# EAGLE design 02A-001 (EAGLE 9.6.2)
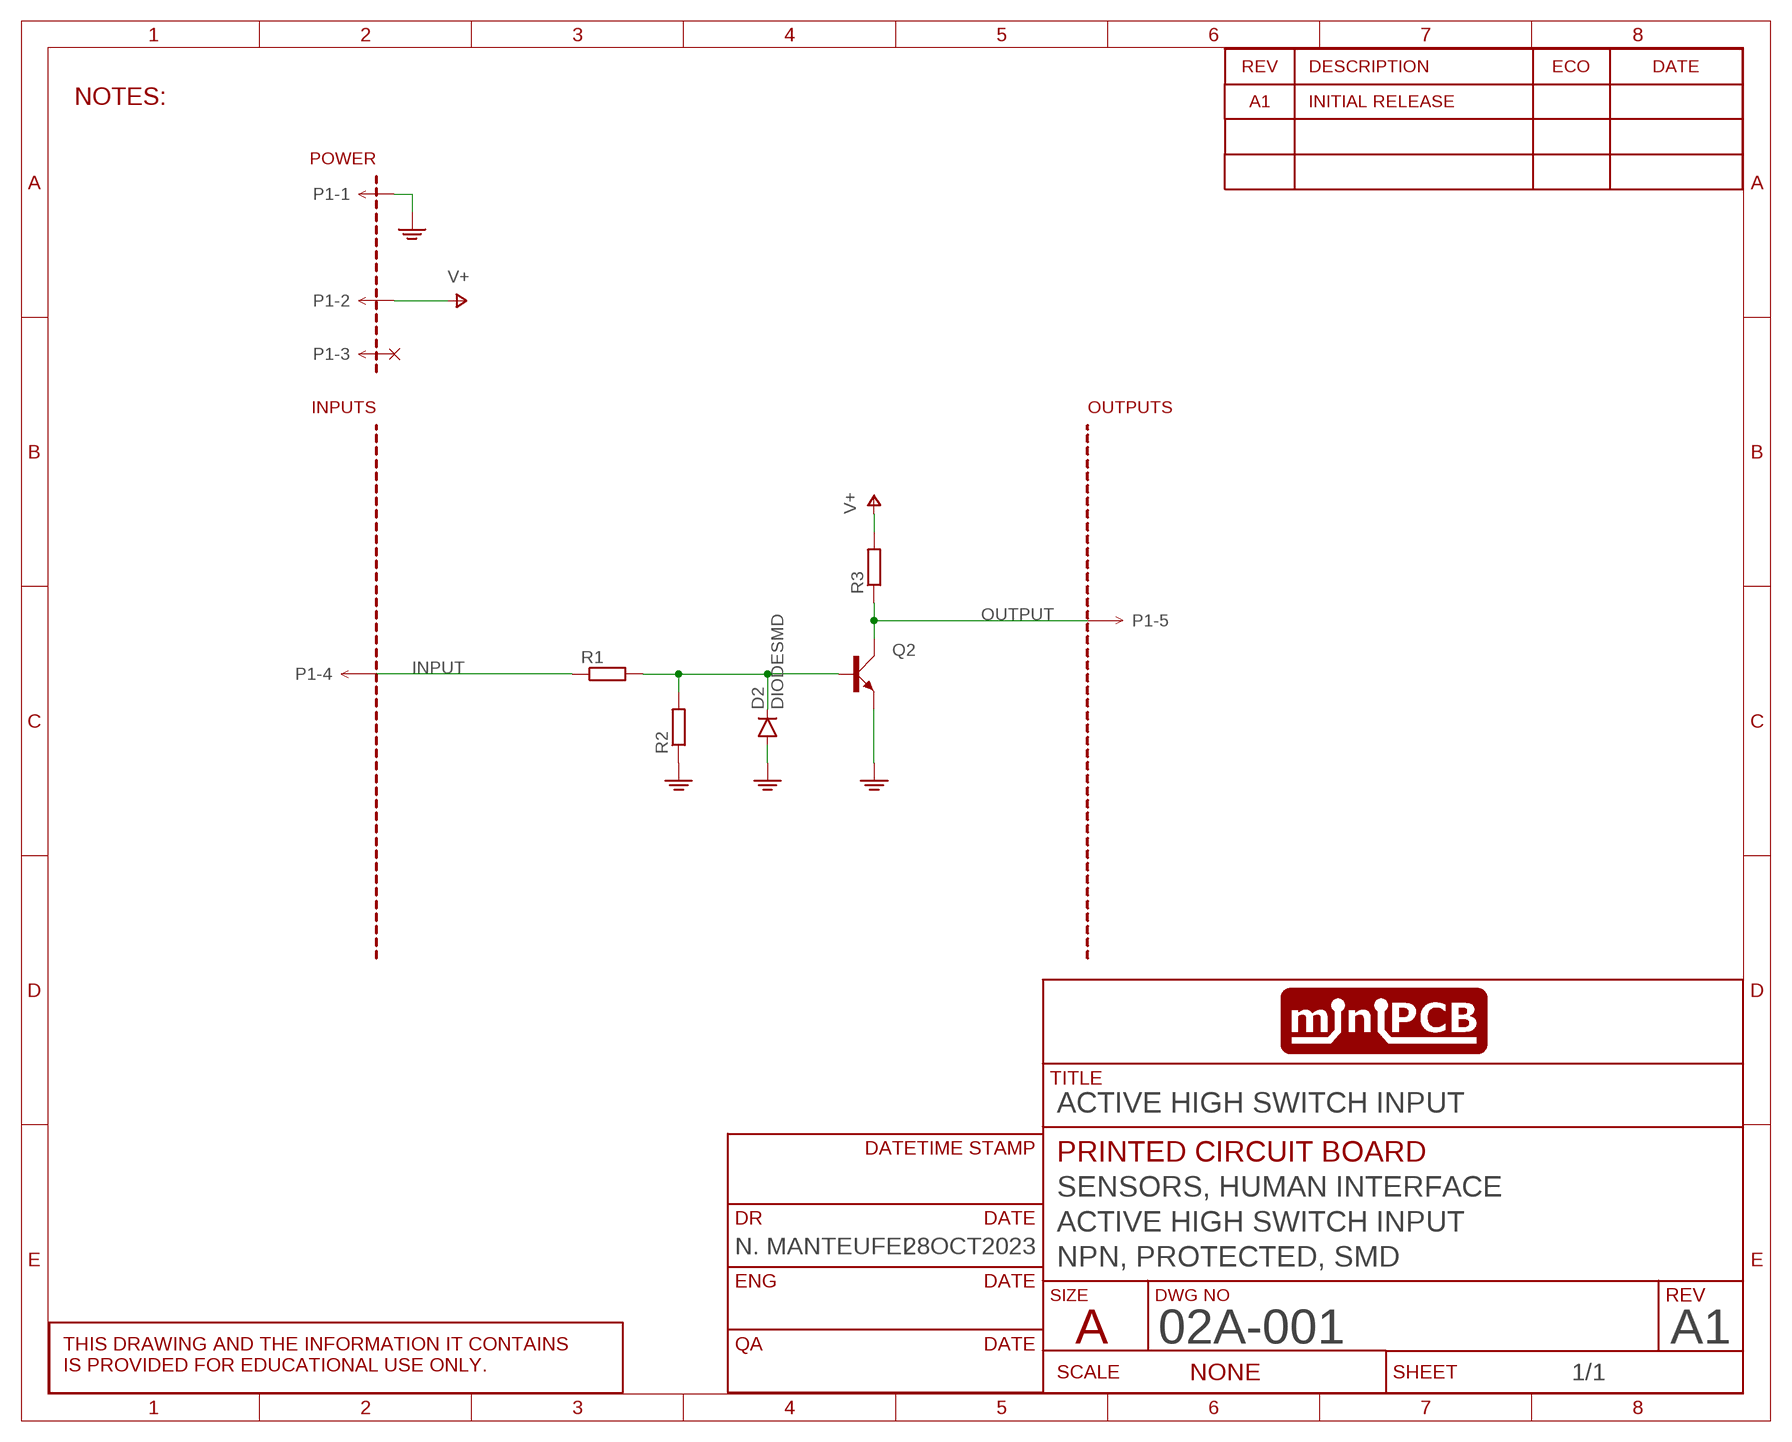
[diagram p0: schematic, sheet 1]
SHEET1 (SCHEMATIC): CIRCUIT_CATEGORY: SENSORS, HUMAN INTERFACE; CIRCUIT_NAME: ACTIVE HIGH SWITCH INPUT; CIRCUIT_VARIANT: NPN, PROTECTED, SMD; DR: N. MANTEUFEL; DR_DATE: 28OCT2023; PCB_PCBA: PRINTED CIRCUIT BOARD; REVA: A1; REVISION: A1; TITLE: ACTIVE HIGH SWITCH INPUT

## Parts
D2  DIODESMD  [DO214AC]
P1  MINIPCB_5P5P  [PINS_1X5]
PCB1  MINIPCB_0P00A-20X25  [MINIPCB_00A_20X25]
Q2  BJT_NPNBEC  [SOT23]
R1  RESISTORSMD  [R0805]
R2  RESISTORSMD  [R0805]
R3  RESISTORSMD  [R0805]

## Nets
GND: D2.A P1.1 Q2.2(E) R2.1
INPUT: P1.4 R1.1
OUTPUT: P1.5 Q2.3(C) R3.1
PROTECTED_INPUT: D2.C Q2.1(B) R1.2 R2.2
V+: P1.2 R3.2
Unconnected: P1.3

## Notes on the sheet
- NOTES:

## Library data of the parts
D2 = minipcb:DIODE
P1 = minipcb:MINIPCB_5P
PCB1 = minipcb:MINIPCB_0P; CIRCUIT_CATEGORY: CIRCUIT CATEGORY; PART_NUMBER: 02A-001; REVISION: A1-01; TITLE: TITLE
Q2 = minipcb:BJT_NPN: TRANSISTOR
R1-R3 = minipcb:RESISTOR

## Board
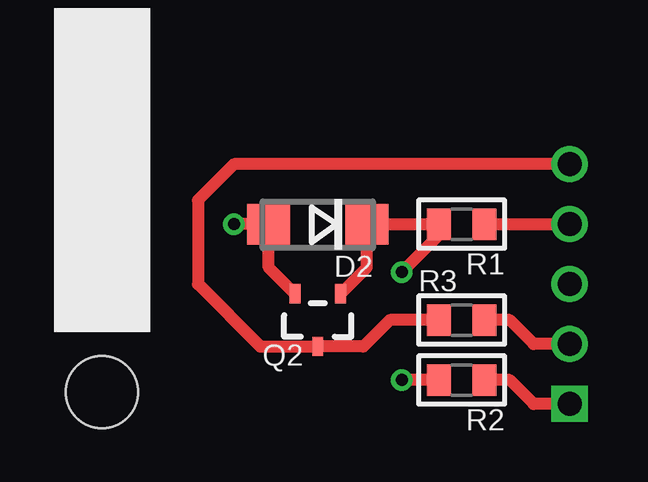
[diagram p1: board, top side]
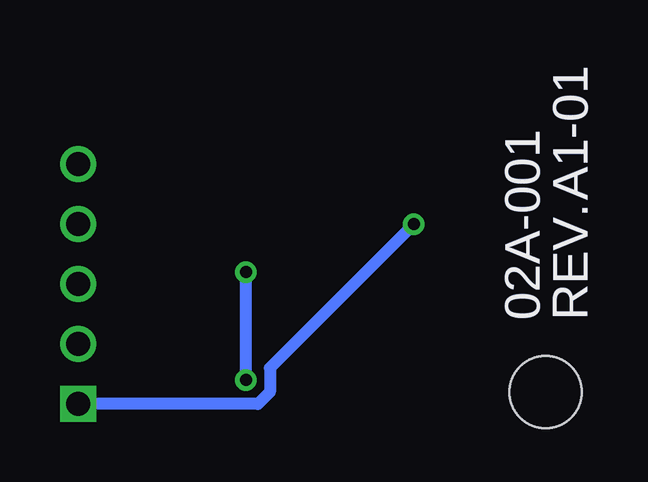
[diagram p2: board, bottom side, seen from below]

No outline drawn. Coordinates in mm, seen from the top.
Copper layers (1*16): Top 0.035mm / dielectric 1.5mm / Bottom 0.035mm
Design rules "default": minimum track width 6mil, minimum drill 0.35mm, track to track 6mil, track to pad 6mil, pad to pad 6mil, via to via 6mil, smd to smd 6mil, copper to edge 40mil, drill to drill 6mil, minimum pad ring 10mil, minimum via ring 8mil, stop-mask expansion 4mil, vias tented up to drill 0mil, thermal gap 10mil

### Footprints (pad centres in the part's own frame; a part is rotated, then mirrored left to right if it is on the bottom)
DO214AC = smd 1.8 x 1.7: A 2.05,0; C -2.05,0
PINS_1X5 = drill 1 square: 1 0,0 | drill 1: 2 2.5,0; 3 5,0; 4 7.5,0; 5 10,0
MINIPCB_00A_20X25 = hole 3: 3,3
SOT23 = smd 0.45 x 0.8: 1 -0.95,-1.1; 2 0.95,-1.1; 3 0,1.1
R0805 = smd 1 x 1.3: 1 -0.95,0; 2 0.95,0

### Placement (x,y rotation side)
D2  12,10 180 top
P1  22.5,2.5 90 top
PCB1  0,0 0 top
Q2  12,6 180 top
R1  18,10 180 top
R2  18,3.5 180 top
R3  18,6 0 top

### Tracks (layer width: path | path; a pad name or v marks a point on that pad's centre or on a via)
GND  (via drill 0.5)
  Top 0.5: P1.1 21,2.5 20,3.5 R2.1 | Q2.2 9.95,8.2 D2.A v8.5,10
  Bottom 0.5: v8.5,10 14.5,4 14.5,3 15,2.5 P1.1
INPUT
  Top 0.5: R1.1 P1.4
OUTPUT
  Top 0.5: R3.1 15,6 13.9,4.9 Q2.3 9.6,4.9 7,7.5 7,11 8.5,12.5 P1.5
PROTECTED_INPUT  (via drill 0.5)
  Top 0.5: R2.2 v15.5,3.5 | v15.5,8 17.05,9.55 R1.2 D2.C 14.05,8.2 Q2.1
  Bottom 0.5: v15.5,3.5 v15.5,8
V+
  Top 0.5: P1.2 21,5 20,6 R3.2